# Altium project Matrix.PrjPcb
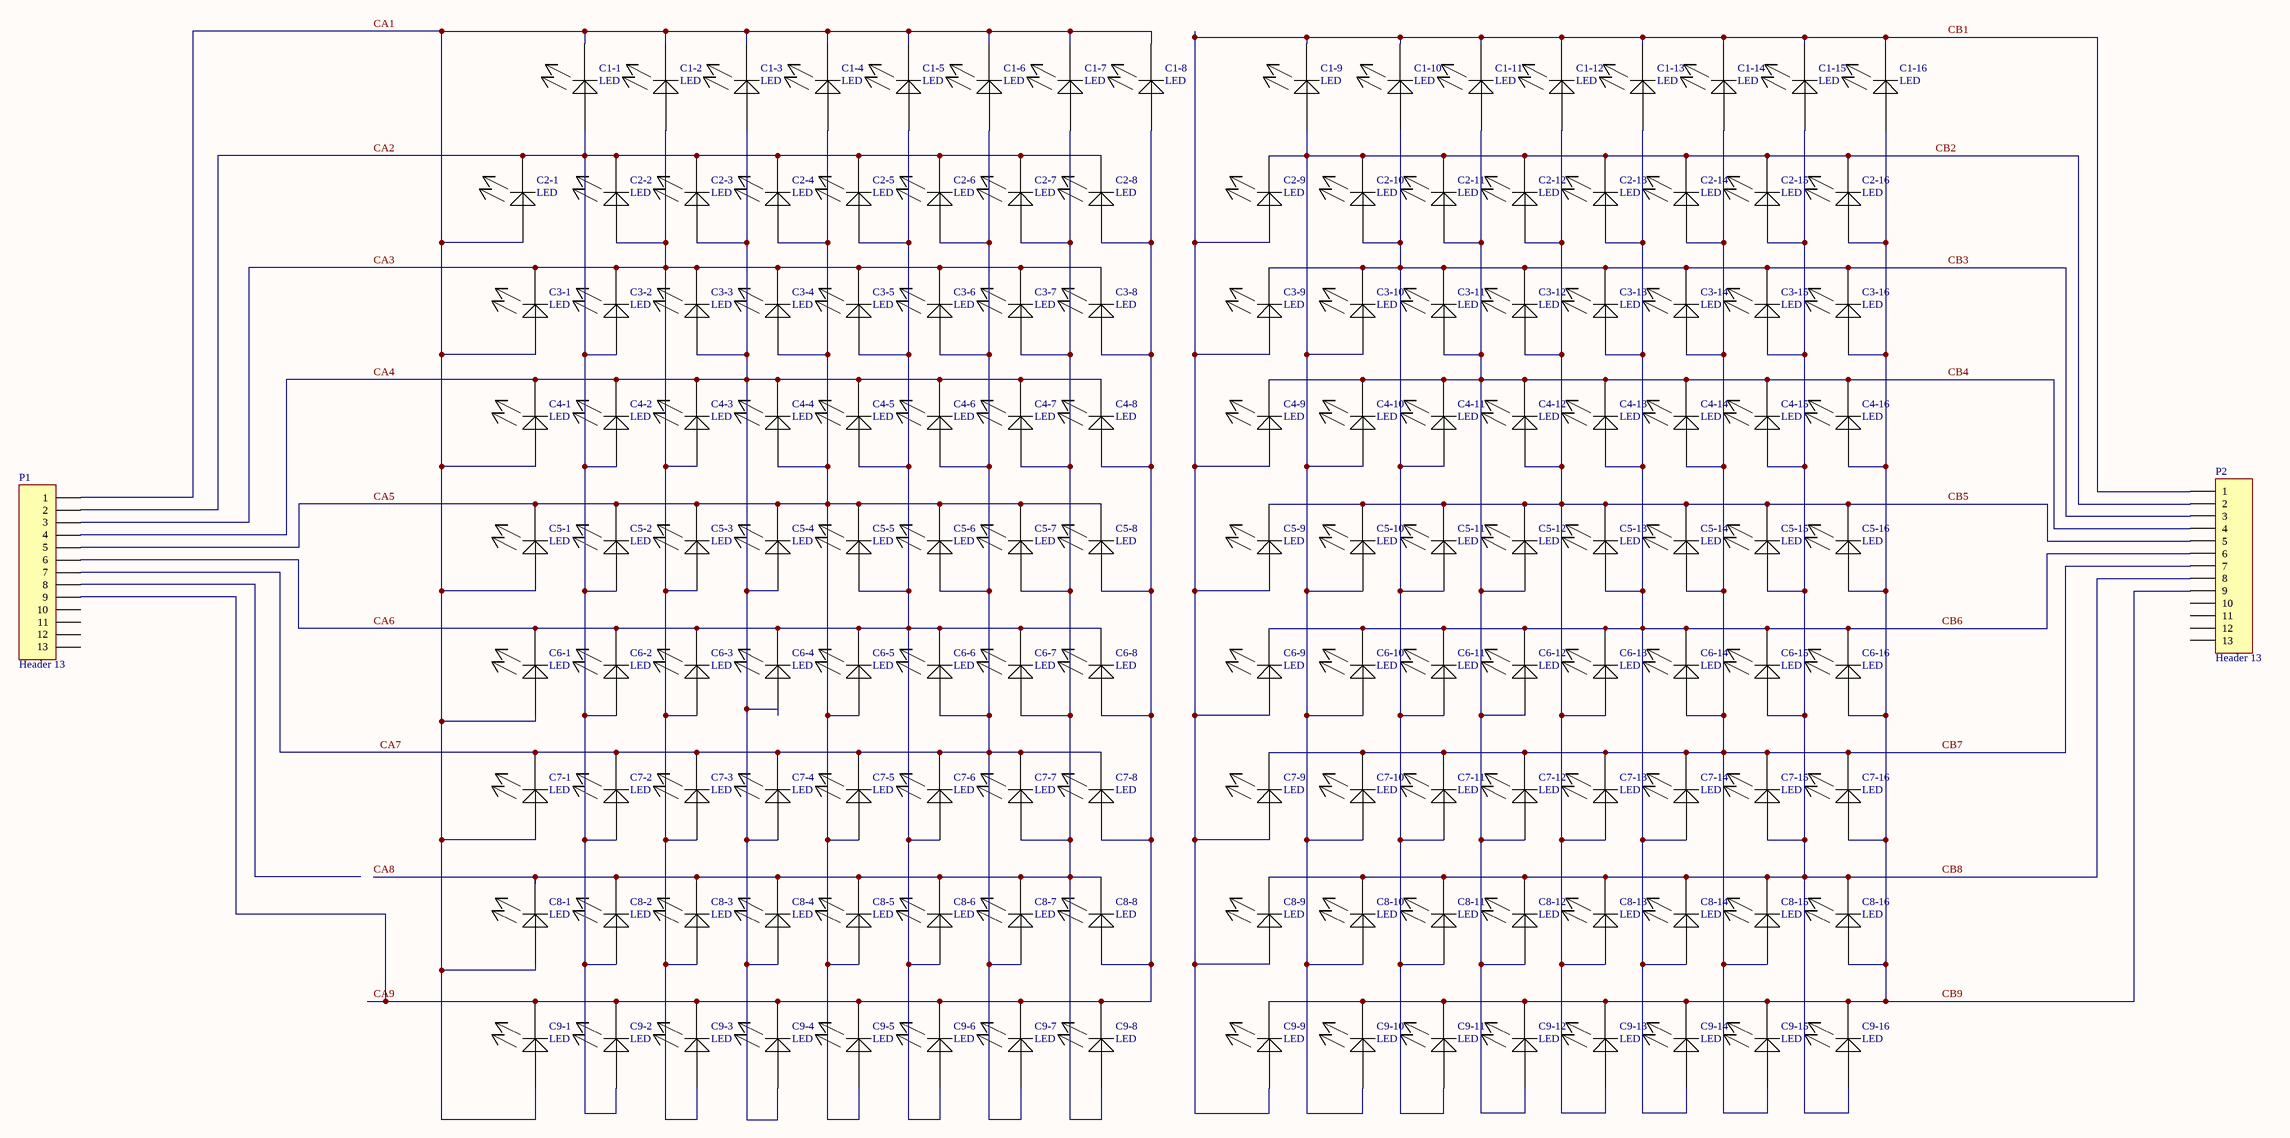
[diagram p0: Sheet1.SchDoc]
2 sheets, 157 parts. Net scope: global (net labels, ports and power ports of the same name join across sheets).
Board file: PCB1.PcbDoc
Sheets:
  Sheet1.SchDoc
  Sheet2.SchDoc

## Sheet Sheet1.SchDoc
size A1

### Parts
(Parts that share a designator on the sheet are numbered #1, #2 ... from top to bottom, then left to right.)
C1-1  LED  [LED 0603(2)]
C1-2  LED  [LED 0603(2)]
C1-3  LED  [LED 0603(2)]
C1-4  LED  [LED 0603(2)]
C1-5  LED  [LED 0603(2)]
C1-6  LED  [LED 0603(2)]
C1-7  LED  [LED 0603(2)]
C1-8  LED  [LED 0603(2)]
C1-9  LED  [LED 0603(2)]
C1-10  LED  [LED 0603(2)]
C1-11  LED  [LED 0603(2)]
C1-12  LED  [LED 0603(2)]
C1-13  LED  [LED 0603(2)]
C1-14  LED  [LED 0603(2)]
C1-15  LED  [LED 0603(2)]
C1-16  LED  [LED 0603(2)]
C2-1  LED  [LED 0603(2)]
C2-2  LED  [LED 0603(2)]
C2-3  LED  [LED 0603(2)]
C2-4  LED  [LED 0603(2)]
C2-5  LED  [LED 0603(2)]
C2-6  LED  [LED 0603(2)]
C2-7  LED  [LED 0603(2)]
C2-8  LED  [LED 0603(2)]
C2-9  LED  [LED 0603(2)]
C2-10  LED  [LED 0603(2)]
C2-11  LED  [LED 0603(2)]
C2-12  LED  [LED 0603(2)]
C2-13  LED  [LED 0603(2)]
C2-14  LED  [LED 0603(2)]
C2-15  LED  [LED 0603(2)]
C2-16  LED  [LED 0603(2)]
C3-1  LED  [LED 0603(2)]
C3-2  LED  [LED 0603(2)]
C3-3  LED  [LED 0603(2)]
C3-4  LED  [LED 0603(2)]
C3-5  LED  [LED 0603(2)]
C3-6  LED  [LED 0603(2)]
C3-7  LED  [LED 0603(2)]
C3-8  LED  [LED 0603(2)]
C3-9  LED  [LED 0603(2)]
C3-10  LED  [LED 0603(2)]
C3-11  LED  [LED 0603(2)]
C3-12  LED  [LED 0603(2)]
C3-13  LED  [LED 0603(2)]
C3-14  LED  [LED 0603(2)]
C3-15  LED  [LED 0603(2)]
C3-16  LED  [LED 0603(2)]
C4-1  LED  [LED 0603(2)]
C4-2  LED  [LED 0603(2)]
C4-3  LED  [LED 0603(2)]
C4-4  LED  [LED 0603(2)]
C4-5  LED  [LED 0603(2)]
C4-6  LED  [LED 0603(2)]
C4-7  LED  [LED 0603(2)]
C4-8  LED  [LED 0603(2)]
C4-9  LED  [LED 0603(2)]
C4-10  LED  [LED 0603(2)]
C4-11  LED  [LED 0603(2)]
C4-12  LED  [LED 0603(2)]
C4-13  LED  [LED 0603(2)]
C4-14  LED  [LED 0603(2)]
C4-15  LED  [LED 0603(2)]
C4-16  LED  [LED 0603(2)]
C5-1  LED  [LED 0603(2)]
C5-2  LED  [LED 0603(2)]
C5-3  LED  [LED 0603(2)]
C5-4  LED  [LED 0603(2)]
C5-5  LED  [LED 0603(2)]
C5-6  LED  [LED 0603(2)]
C5-7  LED  [LED 0603(2)]
C5-8  LED  [LED 0603(2)]
C5-9  LED  [LED 0603(2)]
C5-10  LED  [LED 0603(2)]
C5-11  LED  [LED 0603(2)]
C5-12  LED  [LED 0603(2)]
C5-13  LED  [LED 0603(2)]
C5-14  LED  [LED 0603(2)]
C5-15  LED  [LED 0603(2)]
C5-16  LED  [LED 0603(2)]
C6-1  LED  [LED 0603(2)]
C6-2  LED  [LED 0603(2)]
C6-3  LED  [LED 0603(2)]
C6-4  LED  [LED 0603(2)]
C6-5  LED  [LED 0603(2)]
C6-6  LED  [LED 0603(2)]
C6-7  LED  [LED 0603(2)]
C6-8  LED  [LED 0603(2)]
C6-9  LED  [LED 0603(2)]
C6-10  LED  [LED 0603(2)]
C6-11  LED  [LED 0603(2)]
C6-12  LED  [LED 0603(2)]
C6-13  LED  [LED 0603(2)]
C6-14  LED  [LED 0603(2)]
C6-15  LED  [LED 0603(2)]
C6-16  LED  [LED 0603(2)]
C7-1  LED  [LED 0603(2)]
C7-2  LED  [LED 0603(2)]
C7-3  LED  [LED 0603(2)]
C7-4  LED  [LED 0603(2)]
C7-5  LED  [LED 0603(2)]
C7-6  LED  [LED 0603(2)]
C7-7  LED  [LED 0603(2)]
C7-8  LED  [LED 0603(2)]
C7-9  LED  [LED 0603(2)]
C7-10  LED  [LED 0603(2)]
C7-11  LED  [LED 0603(2)]
C7-12  LED  [LED 0603(2)]
C7-13  LED  [LED 0603(2)]
C7-14  LED  [LED 0603(2)]
C7-15  LED  [LED 0603(2)]
C7-16  LED  [LED 0603(2)]
C8-1  LED  [LED 0603(2)]
C8-2  LED  [LED 0603(2)]
C8-3  LED  [LED 0603(2)]
C8-4  LED  [LED 0603(2)]
C8-5  LED  [LED 0603(2)]
C8-6  LED  [LED 0603(2)]
C8-7  LED  [LED 0603(2)]
C8-8  LED  [LED 0603(2)]
C8-9  LED  [LED 0603(2)]
C8-10  LED  [LED 0603(2)]
C8-11  LED  [LED 0603(2)]
C8-12  LED  [LED 0603(2)]
C8-13  LED  [LED 0603(2)]
C8-14  LED  [LED 0603(2)]
C8-15  LED  [LED 0603(2)]
C8-16  LED  [LED 0603(2)]
C9-1  LED  [LED 0603(2)]
C9-2  LED  [LED 0603(2)]
C9-3  LED  [LED 0603(2)]
C9-4  LED  [LED 0603(2)]
C9-5  LED  [LED 0603(2)]
C9-6  LED  [LED 0603(2)]
C9-7  LED  [LED 0603(2)]
C9-8  LED  [LED 0603(2)]
C9-9  LED  [LED 0603(2)]
C9-10  LED  [LED 0603(2)]
C9-11  LED  [LED 0603(2)]
C9-12  LED  [LED 0603(2)]
C9-13  LED  [LED 0603(2)]
C9-14  LED  [LED 0603(2)]
C9-15  LED  [LED 0603(2)]
C9-16  LED  [LED 0603(2)]
P1#1  Header 13  [HDR1X13]
P2#1  Header 13  [HDR1X13]

### Nets
CA1: C1-1.2(-) C1-2.2(-) C1-3.2(-) C1-4.2(-) C1-5.2(-) C1-6.2(-) C1-7.2(-) C1-8.2(-) C2-1.1(+) C3-1.1(+) C4-1.1(+) C5-1.1(+) C6-1.1(+) C7-1.1(+) C8-1.1(+) C9-1.1(+) P1#1.1
CA2: C1-1.1(+) C2-1.2(-) C2-2.2(-) C2-3.2(-) C2-4.2(-) C2-5.2(-) C2-6.2(-) C2-7.2(-) C2-8.2(-) C3-2.1(+) C4-2.1(+) C5-2.1(+) C6-2.1(+) C7-2.1(+) C8-2.1(+) C9-2.1(+) P1#1.2
CA3: C1-2.1(+) C2-2.1(+) C3-1.2(-) C3-2.2(-) C3-3.2(-) C3-4.2(-) C3-5.2(-) C3-6.2(-) C3-7.2(-) C3-8.2(-) C4-3.1(+) C5-3.1(+) C6-3.1(+) C7-3.1(+) C8-3.1(+) C9-3.1(+) P1#1.3
CA4: C1-3.1(+) C2-3.1(+) C3-3.1(+) C4-1.2(-) C4-2.2(-) C4-3.2(-) C4-4.2(-) C4-5.2(-) C4-6.2(-) C4-7.2(-) C4-8.2(-) C5-4.1(+) C6-4.1(+) C7-4.1(+) C8-4.1(+) C9-4.1(+) P1#1.4
CA5: C1-4.1(+) C2-4.1(+) C3-4.1(+) C4-4.1(+) C5-1.2(-) C5-2.2(-) C5-3.2(-) C5-4.2(-) C5-5.2(-) C5-6.2(-) C5-7.2(-) C5-8.2(-) C6-5.1(+) C7-5.1(+) C8-5.1(+) C9-5.1(+) P1#1.5
CA6: C1-5.1(+) C2-5.1(+) C3-5.1(+) C4-5.1(+) C5-5.1(+) C6-1.2(-) C6-2.2(-) C6-3.2(-) C6-4.2(-) C6-5.2(-) C6-6.2(-) C6-7.2(-) C6-8.2(-) C7-6.1(+) C8-6.1(+) C9-6.1(+) P1#1.6
CA7: C1-6.1(+) C2-6.1(+) C3-6.1(+) C4-6.1(+) C5-6.1(+) C6-6.1(+) C7-1.2(-) C7-2.2(-) C7-3.2(-) C7-4.2(-) C7-5.2(-) C7-6.2(-) C7-7.2(-) C7-8.2(-) C8-7.1(+) C9-7.1(+) P1#1.7
CA8: C1-7.1(+) C2-7.1(+) C3-7.1(+) C4-7.1(+) C5-7.1(+) C6-7.1(+) C7-7.1(+) C8-1.2(-) C8-2.2(-) C8-3.2(-) C8-4.2(-) C8-5.2(-) C8-6.2(-) C8-7.2(-) C8-8.2(-) C9-8.1(+)
CA9: C1-8.1(+) C2-8.1(+) C3-8.1(+) C4-8.1(+) C5-8.1(+) C6-8.1(+) C7-8.1(+) C8-8.1(+) C9-1.2(-) C9-2.2(-) C9-3.2(-) C9-4.2(-) C9-5.2(-) C9-6.2(-) C9-7.2(-) C9-8.2(-) P1#1.9
CB1: C1-9.2(-) C1-10.2(-) C1-11.2(-) C1-12.2(-) C1-13.2(-) C1-14.2(-) C1-15.2(-) C1-16.2(-) C2-9.1(+) C3-9.1(+) C4-9.1(+) C5-9.1(+) C6-9.1(+) C7-9.1(+) C8-9.1(+) C9-9.1(+) P2#1.1
CB2: C1-9.1(+) C2-9.2(-) C2-10.2(-) C2-11.2(-) C2-12.2(-) C2-13.2(-) C2-14.2(-) C2-15.2(-) C2-16.2(-) C3-10.1(+) C4-10.1(+) C5-10.1(+) C6-10.1(+) C7-10.1(+) C8-10.1(+) C9-10.1(+) P2#1.2
CB3: C1-10.1(+) C2-10.1(+) C3-9.2(-) C3-10.2(-) C3-11.2(-) C3-12.2(-) C3-13.2(-) C3-14.2(-) C3-15.2(-) C3-16.2(-) C4-11.1(+) C5-11.1(+) C6-11.1(+) C7-11.1(+) C8-11.1(+) C9-11.1(+) P2#1.3
CB4: C1-11.1(+) C2-11.1(+) C3-11.1(+) C4-9.2(-) C4-10.2(-) C4-11.2(-) C4-12.2(-) C4-13.2(-) C4-14.2(-) C4-15.2(-) C4-16.2(-) C5-12.1(+) C6-12.1(+) C7-12.1(+) C8-12.1(+) C9-12.1(+) P2#1.4
CB5: C1-12.1(+) C2-12.1(+) C3-12.1(+) C4-12.1(+) C5-9.2(-) C5-10.2(-) C5-11.2(-) C5-12.2(-) C5-13.2(-) C5-14.2(-) C5-15.2(-) C5-16.2(-) C6-13.1(+) C7-13.1(+) C8-13.1(+) C9-13.1(+) P2#1.5
CB6: C1-13.1(+) C2-13.1(+) C3-13.1(+) C4-13.1(+) C5-13.1(+) C6-9.2(-) C6-10.2(-) C6-11.2(-) C6-12.2(-) C6-13.2(-) C6-14.2(-) C6-15.2(-) C6-16.2(-) C7-14.1(+) C8-14.1(+) C9-14.1(+) P2#1.6
CB7: C1-14.1(+) C2-14.1(+) C3-14.1(+) C4-14.1(+) C5-14.1(+) C6-14.1(+) C7-9.2(-) C7-10.2(-) C7-11.2(-) C7-12.2(-) C7-13.2(-) C7-14.2(-) C7-15.2(-) C7-16.2(-) C8-15.1(+) C9-15.1(+) P2#1.7
CB8: C1-15.1(+) C2-15.1(+) C3-15.1(+) C4-15.1(+) C5-15.1(+) C6-15.1(+) C7-15.1(+) C8-9.2(-) C8-10.2(-) C8-11.2(-) C8-12.2(-) C8-13.2(-) C8-14.2(-) C8-15.2(-) C8-16.2(-) C9-16.1(+) P2#1.8
CB9: C1-16.1(+) C2-16.1(+) C3-16.1(+) C4-16.1(+) C5-16.1(+) C6-16.1(+) C7-16.1(+) C8-16.1(+) C9-9.2(-) C9-10.2(-) C9-11.2(-) C9-12.2(-) C9-13.2(-) C9-14.2(-) C9-15.2(-) C9-16.2(-) P2#1.9

Not connected (* = marked no-connect by the designer): P1#1 8 10 11 12 13; P2#1 10 11 12 13

### Library data of the parts
P1#1 P2#1 = Header 13: Header, 13-Pin; LatestRevisionDate: 17-Jul-2002; LatestRevisionNote: Re-released for DXP Platform.; Publisher: Altium Limited

## Sheet Sheet2.SchDoc
size A4
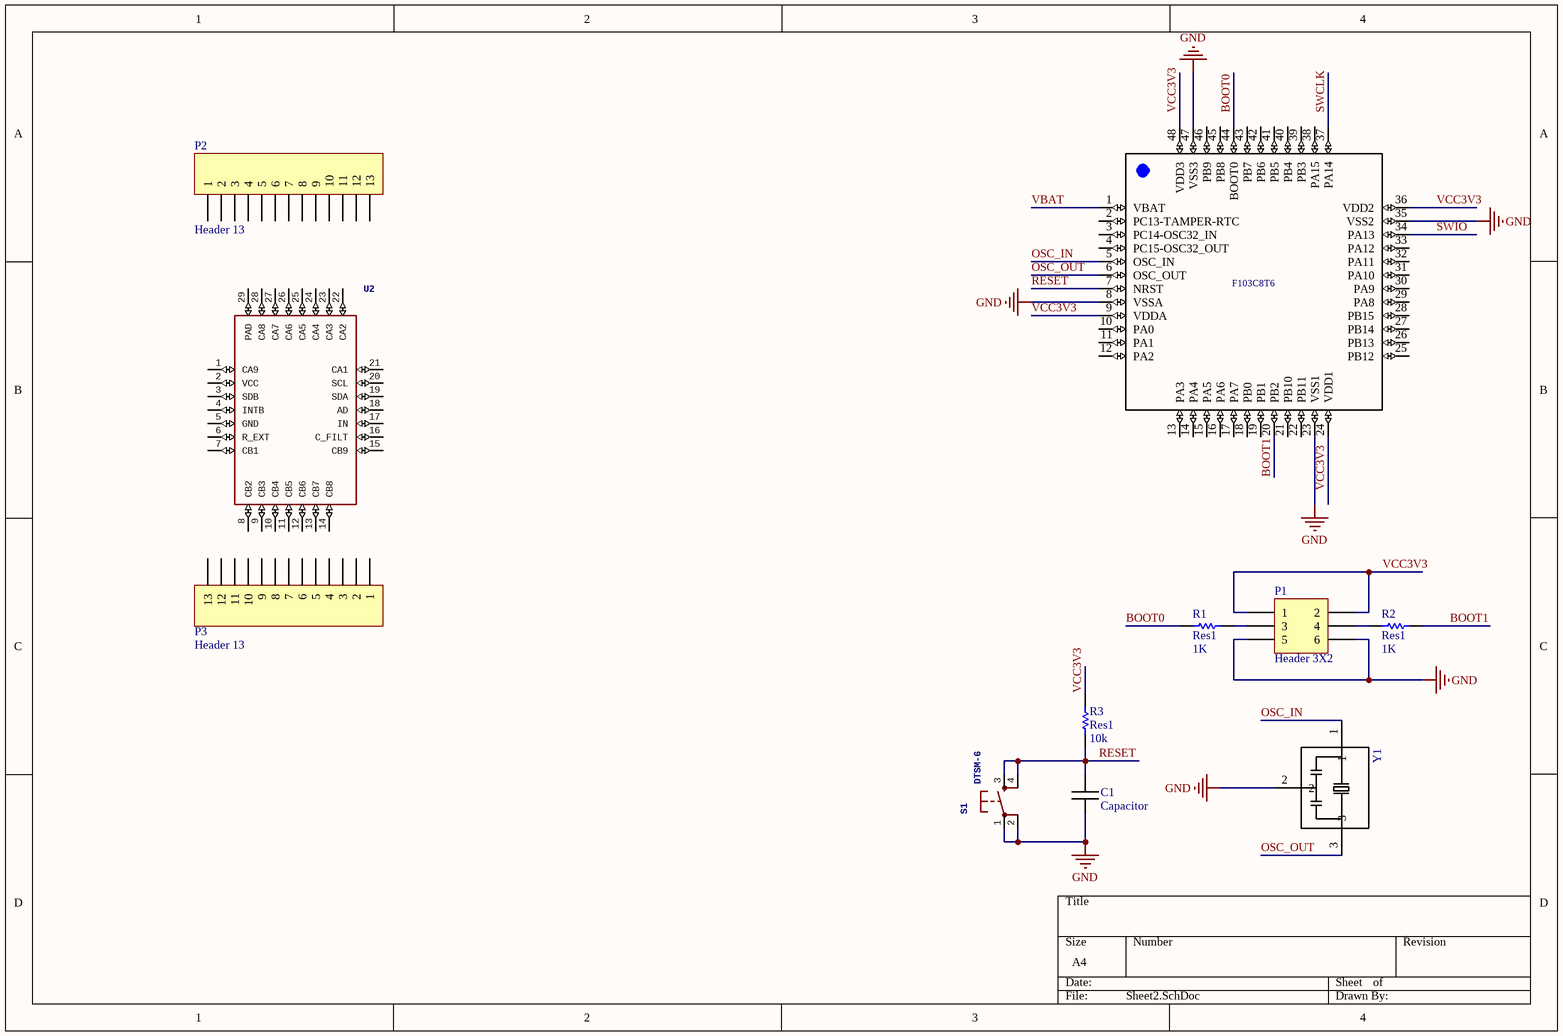
[diagram p1: Sheet2.SchDoc]

### Parts
(Parts that share a designator on the sheet are numbered #1, #2 ... from top to bottom, then left to right.)
C1  Capacitor  [C 0603 / 1608]
P1#2  Header 3X2  [HDR2X3]
P2#2  Header 13  [HDR1X13]
P3  Header 13  [HDR1X13]
R1  Res1  value 1K  [C 0603 / 1608]
R2  Res1  value 1K  [C 0603 / 1608]
R3  Res1  value 10k  [C 0603 / 1608]
S1  DTSM-6  [DTSM-6]
U1  STM32F103C8T6  [LQFP48_7X7MM_0.5MMPP]  (value not drawn)
U2  LED Lighting Drivers LED Driver   Source:  Datasheet  [QFN40P400X400X80-29N]  (value not drawn)
Y1  (no value)  [OSC_CSTCE8M00G55-R0]

### Nets
GND: C1.2 P1#2.5 P1#2.6 S1.1 S1.2 U1.8(VSSA) U1.23(VSS1) U1.35(VSS2) U1.47(VSS3) Y1.2
BOOT0: R1.1 U1.44(BOOT0)
BOOT1: R2.2 U1.20(PB2)
OSC_IN: U1.5(OSC_IN) Y1.1
OSC_OUT: U1.6(OSC_OUT) Y1.3
RESET: C1.1 R3.2 S1.3 S1.4 U1.7(NRST)
SWCLK: U1.37(PA14)
SWIO: U1.34(PA13)
VBAT: U1.1(VBAT)
VCC3V3: P1#2.1 P1#2.2 R3.1 U1.9(VDDA) U1.24(VDD1) U1.36(VDD2) U1.48(VDD3)
NetP1#2_3: P1#2.3 R1.2
NetP1#2_4: P1#2.4 R2.1

Not connected (* = marked no-connect by the designer): P2#2 1 2 3 4 5 6 7 8 9 10 11 12 13; P3 1 2 3 4 5 6 7 8 9 10 11 12 13; U1 2(PC13-TAMPER-RTC) 3(PC14-OSC32_IN) 4(PC15-OSC32_OUT) 10(PA0) 11(PA1) 12(PA2) 13(PA3) 14(PA4) 15(PA5) 16(PA6) 17(PA7) 18(PB0) 19(PB1) 21(PB10) 22(PB11) 25(PB12) 26(PB13) 27(PB14) 28(PB15) 29(PA8) 30(PA9) 31(PA10) 32(PA11) 33(PA12) 38(PA15) 39(PB3) 40(PB4) 41(PB5) 42(PB6) 43(PB7) 45(PB8) 46(PB9); U2 1(CA9) 2(VCC) 3(SDB) 4(INTB) 5(GND) 6(R_EXT) 7(CB1) 8(CB2) 9(CB3) 10(CB4) 11(CB5) 12(CB6) 13(CB7) 14(CB8) 15(CB9) 16(C_FILT) 17(IN) 18(AD) 19(SDA) 20(SCL) 21(CA1) 22(CA2) 23(CA3) 24(CA4) 25(CA5) 26(CA6) 27(CA7) 28(CA8) 29(PAD)

### Notes on the sheet
- (in symbol STM32F103C8T6) F103C8T6

### Library data of the parts
P1#2 = Header 3X2: Header, 3-Pin, Dual row; LatestRevisionDate: 17-Jul-2002; LatestRevisionNote: Re-released for DXP Platform.; Publisher: Altium Limited
P2#2 P3 = Header 13: Header, 13-Pin; LatestRevisionDate: 17-Jul-2002; LatestRevisionNote: Re-released for DXP Platform.; Publisher: Altium Limited
R1-R3 = Res1: Resistor; Published: 8-Jun-2000; LatestRevisionDate: 17-Jul-2002; LatestRevisionNote: Re-released for DXP Platform.; PackageReference: AXIAL-0.3; Publisher: Altium Limited; PackageDescription: Axial Device, Thru-Hole; 2 Leads; 0.3 in Pin Spacing
U1 = STM32F103C8T6: Mainstream Performance line, ARM Cortex-M3 MCU with 64 Kbytes Flash, 72 MHz CPU, motor control, USB and CAN; MF: STMicroelectronics; Price: 4.41 USD; Package: LQFP-48 STMicroelectronics; Availability: Good; MP: STM32F103C8T6; Value: *
U2 = IS31FL3731-QFLS2-TR: Manufacturer_Name: Integrated Silicon Solution Inc.; Manufacturer_Part_Number: IS31FL3731-QFLS2-TR; Arrow_Part_Number: IS31FL3731-QFLS2-TR; Arrow_Price-Stock: https://www.arrow.com/en/products/is31fl3731-qfls2-tr/integrated-silicon-solution-inc; Height: 0.8mm
Y1 = CSTCE8M00G55-R0: Ceramic Resonator 8MHz ??0.5% _Tol_ ??0.2% _Stability_ 33pF 40Ohm 3-Pin CSMD T/R; MF: Murata; SnapEDA_Link: https://www.snapeda.com/parts/CSTCE8M00G55-R0/Murata%20Electronics%20North%20America/view-part/?ref=snap; Availability: Good; MP: CSTCE8M00G55-R0; Price: 0.27 USD; Package: SMD-3 Murata; Value: *